# Altium schematic sheet Banks_11_12.SchDoc: FPGA Motherboard for Digital Multiplexed Readout, McGill U.
size Tabloid; DocumentNumber: DfMUX7; Revision: Rev0, Prototype; SheetNumber: 7; SheetTotal: 27; PageSetup: Record=PageOptions|CenterHorizontal=True|CenterVertical=True|PrintScale=0.95|XCorrection=1.00|YCorrection=1.00|PrintKind=0|BorderSize=5000000|LeftOffset=0|BottomOffset=0|Orientation=2|PaperLength=1000|PaperWidth=1000|Scale=100|PaperSource=7|PrintQuality=-4|MediaType=1|DitherType=10|PaperKind=Tabloid|PrintScaleMode=1
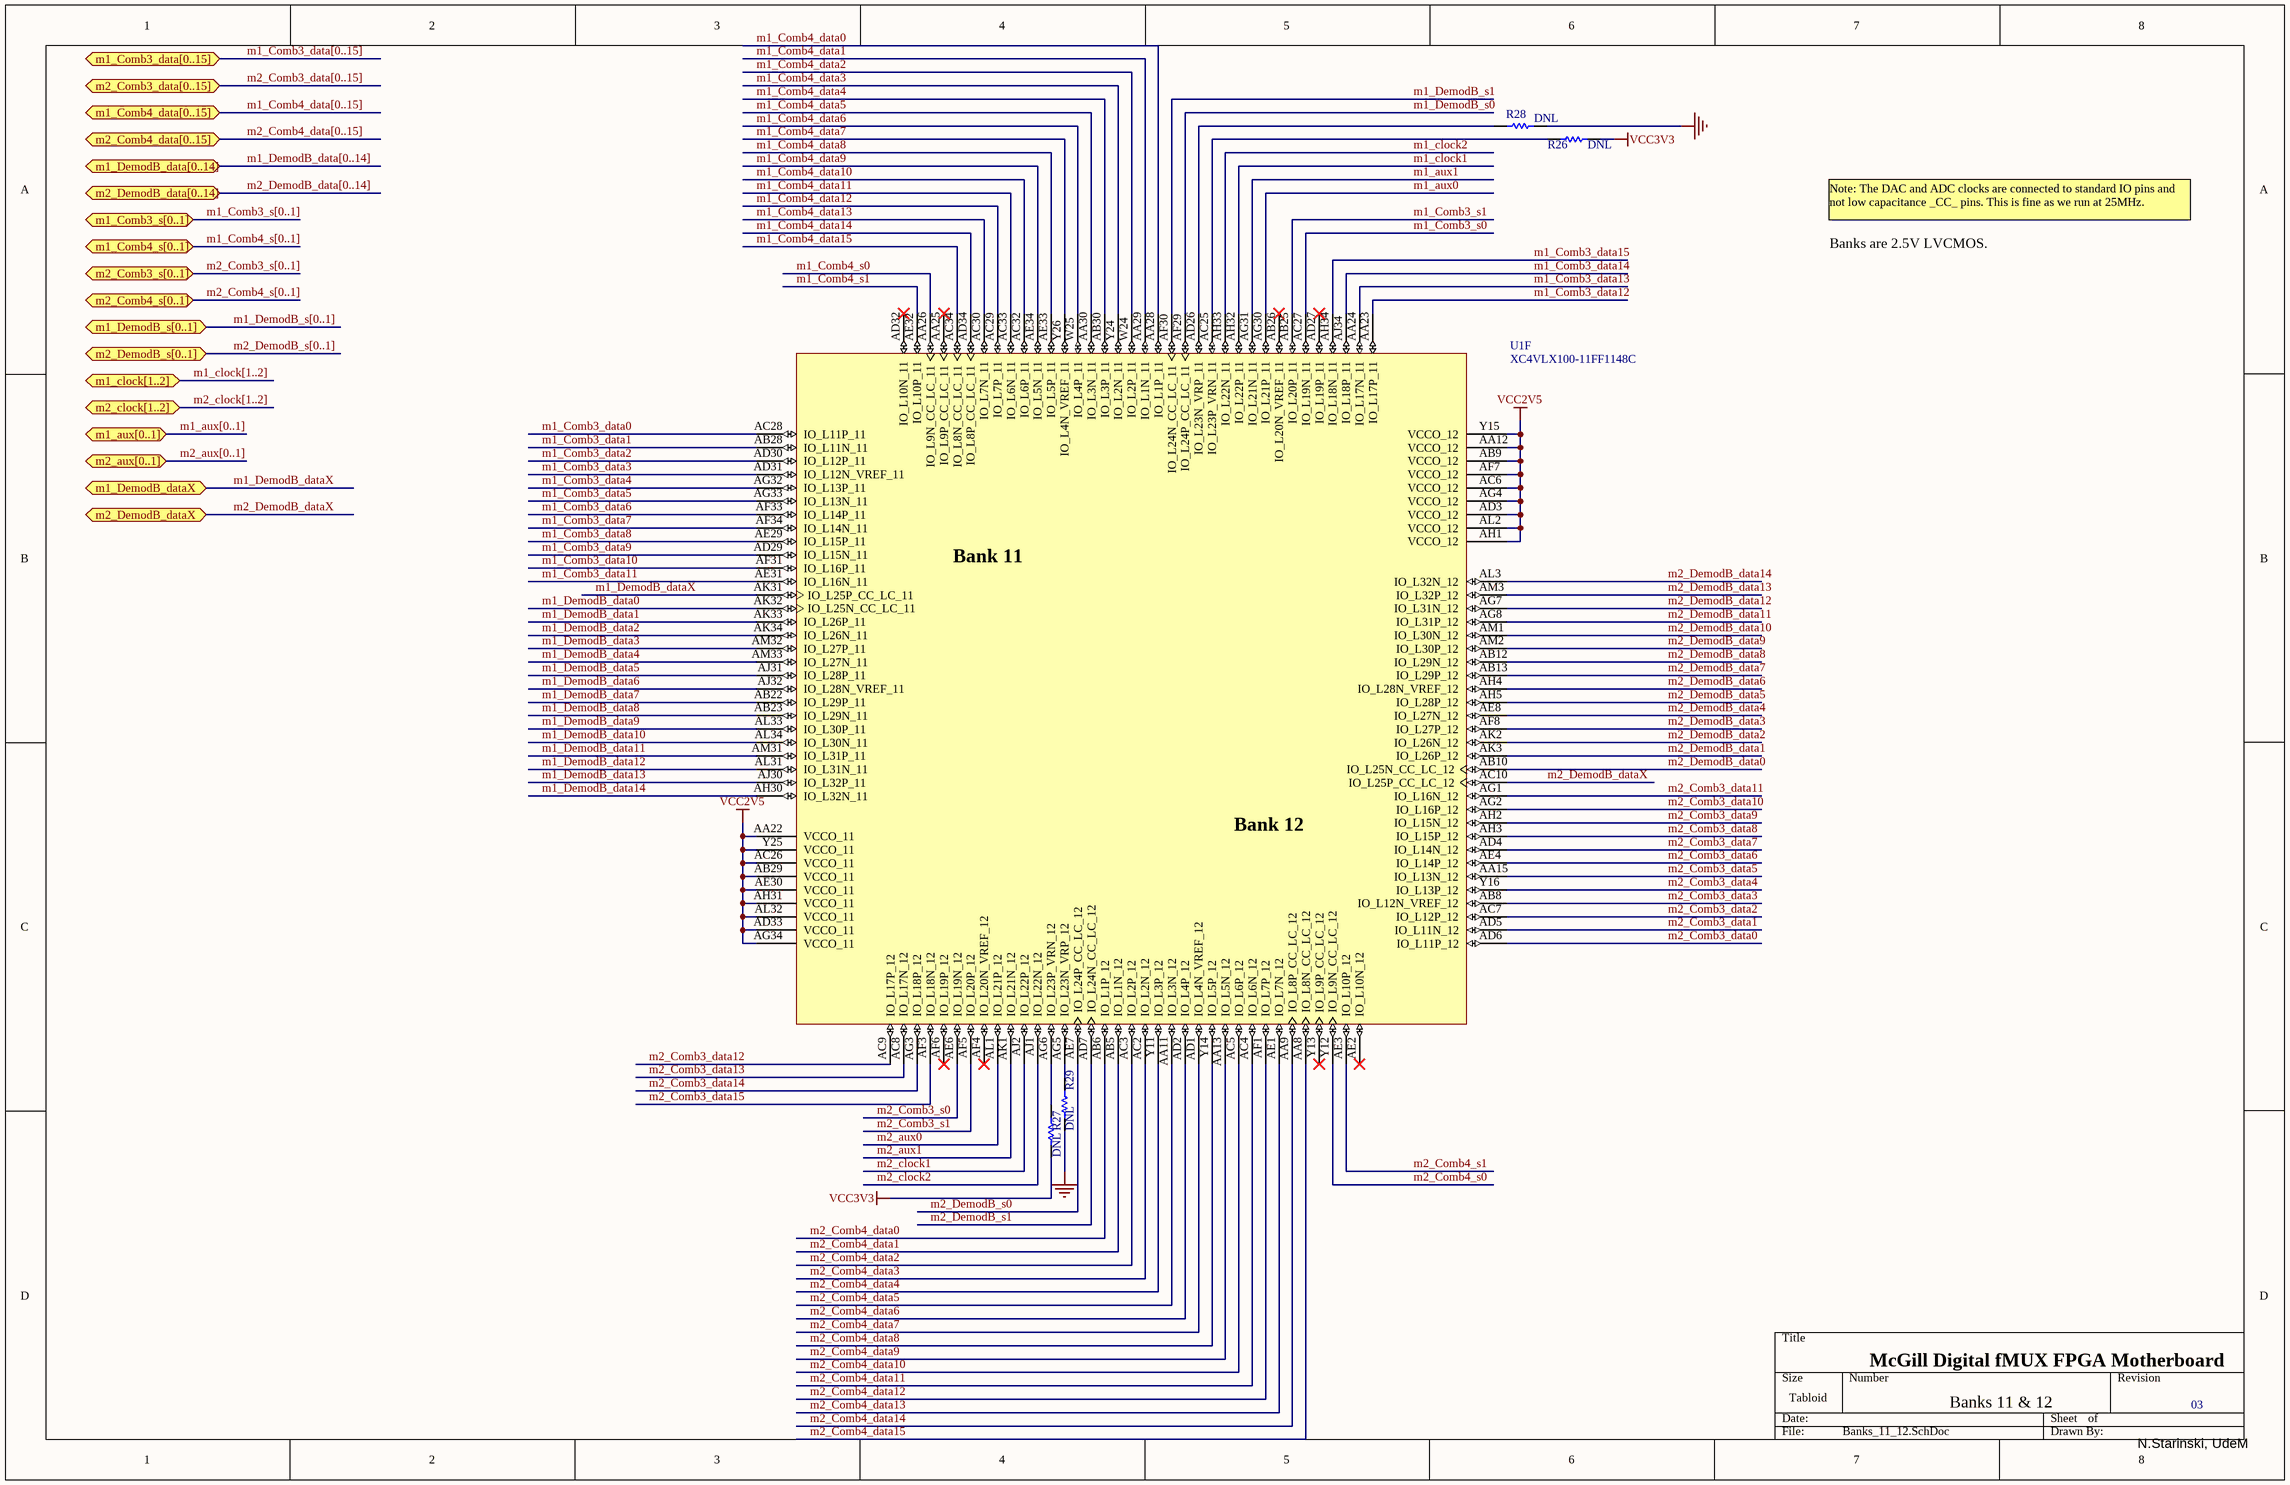
[diagram p0: Banks_11_12.SchDoc]

## Parts
R26  DNL  [CR1608-0603]
R27  DNL  [CR1608-0603]
R28  DNL  [CR1608-0603]
R29  DNL  [CR1608-0603]
U1  XC4VLX100-11FF1148C  [FF1148]  (part F of 10)

## Ports
m1_aux[0..1] (bidir), m1_clock[1..2] (bidir), m1_Comb3_data[0..15] (bidir), m1_Comb3_s[0..1] (bidir), m1_Comb4_data[0..15] (bidir), m1_Comb4_s[0..1] (bidir), m1_DemodB_data[0..14] (bidir), m1_DemodB_dataX (bidir), m1_DemodB_s[0..1] (bidir), m2_aux[0..1] (bidir), m2_clock[1..2] (bidir), m2_Comb3_data[0..15] (bidir), m2_Comb3_s[0..1] (bidir), m2_Comb4_data[0..15] (bidir), m2_Comb4_s[0..1] (bidir), m2_DemodB_data[0..14] (bidir), m2_DemodB_dataX (bidir), m2_DemodB_s[0..1] (bidir)

## Nets
GND: R28.2 R29.1
VCC2V5: U1.AA12(VCCO_12) U1.AA22(VCCO_11) U1.AB9(VCCO_12) U1.AB29(VCCO_11) U1.AC6(VCCO_12) U1.AC26(VCCO_11) U1.AD3(VCCO_12) U1.AD33(VCCO_11) U1.AE30(VCCO_11) U1.AF7(VCCO_12) U1.AG4(VCCO_12) U1.AG34(VCCO_11) U1.AH1(VCCO_12) U1.AH31(VCCO_11) U1.AL2(VCCO_12) U1.AL32(VCCO_11) U1.Y15(VCCO_12) U1.Y25(VCCO_11)
VCC3V3: R26.2 R27.1
m1_aux0: U1.AG30(IO_L21P_11)
m1_aux1: U1.AG31(IO_L21N_11)
m1_clock1: U1.AH32(IO_L22P_11)
m1_clock2: U1.AH33(IO_L22N_11)
m1_Comb3_data0: U1.AC28(IO_L11P_11)
m1_Comb3_data1: U1.AB28(IO_L11N_11)
m1_Comb3_data2: U1.AD30(IO_L12P_11)
m1_Comb3_data3: U1.AD31(IO_L12N_VREF_11)
m1_Comb3_data4: U1.AG32(IO_L13P_11)
m1_Comb3_data5: U1.AG33(IO_L13N_11)
m1_Comb3_data6: U1.AF33(IO_L14P_11)
m1_Comb3_data7: U1.AF34(IO_L14N_11)
m1_Comb3_data8: U1.AE29(IO_L15P_11)
m1_Comb3_data9: U1.AD29(IO_L15N_11)
m1_Comb3_data10: U1.AF31(IO_L16P_11)
m1_Comb3_data11: U1.AE31(IO_L16N_11)
m1_Comb3_data12: U1.AA23(IO_L17P_11)
m1_Comb3_data13: U1.AA24(IO_L17N_11)
m1_Comb3_data14: U1.AJ34(IO_L18P_11)
m1_Comb3_data15: U1.AH34(IO_L18N_11)
m1_Comb3_s0: U1.AC27(IO_L19N_11)
m1_Comb3_s1: U1.AB25(IO_L20P_11)
m1_Comb4_data0: U1.AA28(IO_L1P_11)
m1_Comb4_data1: U1.AA29(IO_L1N_11)
m1_Comb4_data2: U1.W24(IO_L2P_11)
m1_Comb4_data3: U1.Y24(IO_L2N_11)
m1_Comb4_data4: U1.AB30(IO_L3P_11)
m1_Comb4_data5: U1.AA30(IO_L3N_11)
m1_Comb4_data6: U1.W25(IO_L4P_11)
m1_Comb4_data7: U1.Y26(IO_L4N_VREF_11)
m1_Comb4_data8: U1.AE33(IO_L5P_11)
m1_Comb4_data9: U1.AE34(IO_L5N_11)
m1_Comb4_data10: U1.AC32(IO_L6P_11)
m1_Comb4_data11: U1.AC33(IO_L6N_11)
m1_Comb4_data12: U1.AC29(IO_L7P_11)
m1_Comb4_data13: U1.AC30(IO_L7N_11)
m1_Comb4_data14: U1.AD34(IO_L8P_CC_LC_11)
m1_Comb4_data15: U1.AC34(IO_L8N_CC_LC_11)
m1_Comb4_s0: U1.AA26(IO_L9N_CC_LC_11)
m1_Comb4_s1: U1.AE32(IO_L10P_11)
m1_DemodB_data0: U1.AK32(IO_L25N_CC_LC_11)
m1_DemodB_data1: U1.AK33(IO_L26P_11)
m1_DemodB_data2: U1.AK34(IO_L26N_11)
m1_DemodB_data3: U1.AM32(IO_L27P_11)
m1_DemodB_data4: U1.AM33(IO_L27N_11)
m1_DemodB_data5: U1.AJ31(IO_L28P_11)
m1_DemodB_data6: U1.AJ32(IO_L28N_VREF_11)
m1_DemodB_data7: U1.AB22(IO_L29P_11)
m1_DemodB_data8: U1.AB23(IO_L29N_11)
m1_DemodB_data9: U1.AL33(IO_L30P_11)
m1_DemodB_data10: U1.AL34(IO_L30N_11)
m1_DemodB_data11: U1.AM31(IO_L31P_11)
m1_DemodB_data12: U1.AL31(IO_L31N_11)
m1_DemodB_data13: U1.AJ30(IO_L32P_11)
m1_DemodB_data14: U1.AH30(IO_L32N_11)
m1_DemodB_dataX: U1.AK31(IO_L25P_CC_LC_11) ; port m1_DemodB_dataX
m1_DemodB_s0: U1.AF29(IO_L24P_CC_LC_11)
m1_DemodB_s1: U1.AF30(IO_L24N_CC_LC_11)
m2_aux0: U1.AL1(IO_L21P_12)
m2_aux1: U1.AK1(IO_L21N_12)
m2_clock1: U1.AJ2(IO_L22P_12)
m2_clock2: U1.AJ1(IO_L22N_12)
m2_Comb3_data0: U1.AD6(IO_L11P_12)
m2_Comb3_data1: U1.AD5(IO_L11N_12)
m2_Comb3_data2: U1.AC7(IO_L12P_12)
m2_Comb3_data3: U1.AB8(IO_L12N_VREF_12)
m2_Comb3_data4: U1.Y16(IO_L13P_12)
m2_Comb3_data5: U1.AA15(IO_L13N_12)
m2_Comb3_data6: U1.AE4(IO_L14P_12)
m2_Comb3_data7: U1.AD4(IO_L14N_12)
m2_Comb3_data8: U1.AH3(IO_L15P_12)
m2_Comb3_data9: U1.AH2(IO_L15N_12)
m2_Comb3_data10: U1.AG2(IO_L16P_12)
m2_Comb3_data11: U1.AG1(IO_L16N_12)
m2_Comb3_data12: U1.AC9(IO_L17P_12)
m2_Comb3_data13: U1.AC8(IO_L17N_12)
m2_Comb3_data14: U1.AG3(IO_L18P_12)
m2_Comb3_data15: U1.AF3(IO_L18N_12)
m2_Comb3_s0: U1.AE6(IO_L19N_12)
m2_Comb3_s1: U1.AF5(IO_L20P_12)
m2_Comb4_data0: U1.AB6(IO_L1P_12)
m2_Comb4_data1: U1.AB5(IO_L1N_12)
m2_Comb4_data2: U1.AC3(IO_L2P_12)
m2_Comb4_data3: U1.AC2(IO_L2N_12)
m2_Comb4_data4: U1.Y11(IO_L3P_12)
m2_Comb4_data5: U1.AA11(IO_L3N_12)
m2_Comb4_data6: U1.AD2(IO_L4P_12)
m2_Comb4_data7: U1.AD1(IO_L4N_VREF_12)
m2_Comb4_data8: U1.Y14(IO_L5P_12)
m2_Comb4_data9: U1.AA13(IO_L5N_12)
m2_Comb4_data10: U1.AC5(IO_L6P_12)
m2_Comb4_data11: U1.AC4(IO_L6N_12)
m2_Comb4_data12: U1.AF1(IO_L7P_12)
m2_Comb4_data13: U1.AE1(IO_L7N_12)
m2_Comb4_data14: U1.AA9(IO_L8P_CC_LC_12)
m2_Comb4_data15: U1.AA8(IO_L8N_CC_LC_12)
m2_Comb4_s0: U1.Y12(IO_L9N_CC_LC_12)
m2_Comb4_s1: U1.AE3(IO_L10P_12)
m2_DemodB_data0: U1.AB10(IO_L25N_CC_LC_12)
m2_DemodB_data1: U1.AK3(IO_L26P_12)
m2_DemodB_data2: U1.AK2(IO_L26N_12)
m2_DemodB_data3: U1.AF8(IO_L27P_12)
m2_DemodB_data4: U1.AE8(IO_L27N_12)
m2_DemodB_data5: U1.AH5(IO_L28P_12)
m2_DemodB_data6: U1.AH4(IO_L28N_VREF_12)
m2_DemodB_data7: U1.AB13(IO_L29P_12)
m2_DemodB_data8: U1.AB12(IO_L29N_12)
m2_DemodB_data9: U1.AM2(IO_L30P_12)
m2_DemodB_data10: U1.AM1(IO_L30N_12)
m2_DemodB_data11: U1.AG8(IO_L31P_12)
m2_DemodB_data12: U1.AG7(IO_L31N_12)
m2_DemodB_data13: U1.AM3(IO_L32P_12)
m2_DemodB_data14: U1.AL3(IO_L32N_12)
m2_DemodB_dataX: U1.AC10(IO_L25P_CC_LC_12) ; port m2_DemodB_dataX
m2_DemodB_s0: U1.AE7(IO_L24P_CC_LC_12)
m2_DemodB_s1: U1.AD7(IO_L24N_CC_LC_12)
NetR26_1: R26.1 U1.AC25(IO_L23P_VRN_11)
NetR27_2: R27.2 U1.AG6(IO_L23P_VRN_12)
NetR28_1: R28.1 U1.AD26(IO_L23N_VRP_11)
NetR29_2: R29.2 U1.AG5(IO_L23N_VRP_12)

Not connected (* = marked no-connect by the designer): U1 AA25(IO_L9P_CC_LC_11)* AB26(IO_L20N_VREF_11)* AD27(IO_L19P_11)* AD32(IO_L10N_11)* AE2(IO_L10N_12)* AF4(IO_L20N_VREF_12)* AF6(IO_L19P_12)* Y13(IO_L9P_CC_LC_12)*

## Buses and harness runs
bus m1_aux[0..1] = port m1_aux[0..1]
bus m1_clock[1..2] = port m1_clock[1..2]
bus m1_Comb3_data[0..15] = port m1_Comb3_data[0..15]
bus m1_Comb3_s[0..1] = port m1_Comb3_s[0..1]
bus m1_Comb4_data[0..15] = port m1_Comb4_data[0..15]
bus m1_Comb4_s[0..1] = port m1_Comb4_s[0..1]
bus m1_DemodB_data[0..14] = port m1_DemodB_data[0..14]
bus m1_DemodB_s[0..1] = port m1_DemodB_s[0..1]
bus m2_aux[0..1] = port m2_aux[0..1]
bus m2_clock[1..2] = port m2_clock[1..2]
bus m2_Comb3_data[0..15] = port m2_Comb3_data[0..15]
bus m2_Comb3_s[0..1] = port m2_Comb3_s[0..1]
bus m2_Comb4_data[0..15] = port m2_Comb4_data[0..15]
bus m2_Comb4_s[0..1] = port m2_Comb4_s[0..1]
bus m2_DemodB_data[0..14] = port m2_DemodB_data[0..14]
bus m2_DemodB_s[0..1] = port m2_DemodB_s[0..1]

## Notes on the sheet
- Note: The DAC and ADC clocks are connected to standard IO pins and not low capacitance _CC_ pins. This is fine as we run at 25MHz.
- Banks are 2.5V LVCMOS.
- McGill Digital fMUX FPGA Motherboard
- Banks 11 & 12
- 03
- N.Starinski, UdeM
- (in symbol XC4VLX100-11FF1148C, part F) Bank 11; Bank 12

## Library data of the parts
R26-R29 = Res Semi: Semiconductor Resistor; Published: 8-Jun-2000; LatestRevisionDate: 17-Jul-2002; LatestRevisionNote: Re-released for DXP Platform.; Publisher: Altium Limited
U1 = XC4VLX100-11FF1148C: Xilinx Virtex-4 LX Platform FPGA, 1148-Ball FFBGA, Speed Grade 11, 768 User I/Os, Commercial Grade; PackageDocument: ver1.0, Oct-2002; Published: 13-Dec-2004; LatestRevisionDate: 4-Mar-2005; LatestRevisionNote: D_IN & CS_B pins changed from I/O to Input. DOUT_BUSY pin changed from I/O to Output.; DatasheetDocument: ver1.2, Dec-2004; PackageReference: FF1148; Publisher: Altium Limited; ComponentLink2Description: Virtex-4 Overview; ComponentLink2URL: http://www.xilinx.com/products/virtex4/overview.htm; ComponentLink3Description: Datasheet; ComponentLink3URL: http://direct.xilinx.com/bvdocs/userguides/ug075.pdf; Code_JEDEC: MS-034-AAR-1